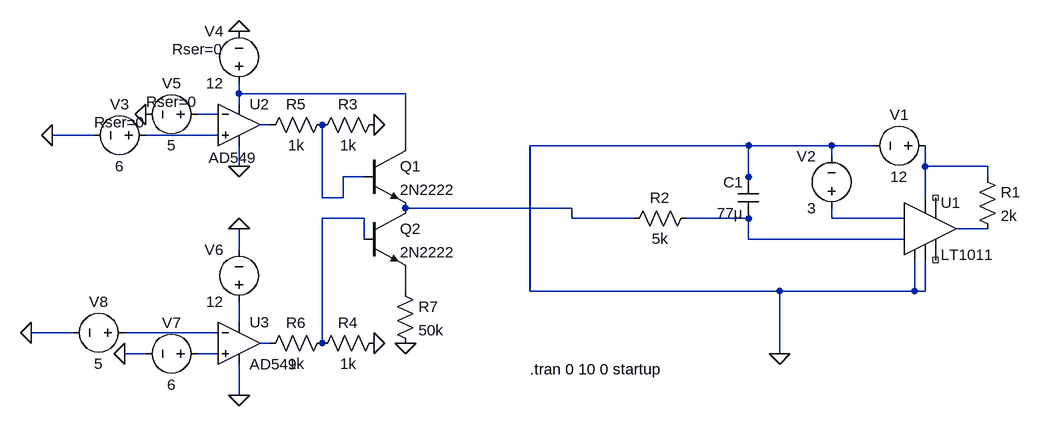
[diagram p0: schematic LT1011_TEST.asc]
LT1011_TEST.asc, the LTspice schematic file:
Version 4
SHEET 1 880 680
WIRE -1152 32 -1152 16
WIRE -896 32 -1152 32
WIRE -1152 48 -1152 32
WIRE -1184 64 -1216 64
WIRE -1104 80 -1120 80
WIRE -1376 96 -1440 96
WIRE -1184 96 -1296 96
WIRE -896 112 -896 32
WIRE -368 112 -704 112
WIRE -240 112 -368 112
WIRE -176 112 -240 112
WIRE -240 128 -240 112
WIRE -1152 144 -1152 112
WIRE -96 144 -96 112
WIRE 0 144 -96 144
WIRE -960 160 -992 160
WIRE -368 160 -368 112
WIRE 0 160 0 144
WIRE -368 176 -368 160
WIRE -1024 192 -1024 80
WIRE -992 192 -992 160
WIRE -992 192 -1024 192
WIRE -96 192 -96 144
WIRE -640 208 -896 208
WIRE -960 224 -1024 224
WIRE -640 224 -640 208
WIRE -544 224 -640 224
WIRE -368 224 -464 224
WIRE -240 224 -240 208
WIRE -128 224 -240 224
WIRE 0 240 -48 240
WIRE -960 256 -960 224
WIRE -368 256 -368 224
WIRE -128 256 -368 256
WIRE -1152 272 -1152 240
WIRE -896 336 -896 304
WIRE -704 336 -704 112
WIRE -320 336 -704 336
WIRE -112 336 -112 288
WIRE -112 336 -320 336
WIRE -96 336 -96 288
WIRE -96 336 -112 336
WIRE -1152 384 -1152 352
WIRE -1408 400 -1472 400
WIRE -1184 400 -1328 400
WIRE -1104 416 -1120 416
WIRE -1024 416 -1024 224
WIRE -1296 432 -1328 432
WIRE -1184 432 -1216 432
WIRE -320 432 -320 336
WIRE -1152 496 -1152 448
FLAG -320 432 0
FLAG -1440 96 0
FLAG -1152 -64 0
FLAG -1152 144 0
FLAG -1296 64 0
FLAG -1152 496 0
FLAG -1152 240 0
FLAG -1328 432 0
FLAG -1472 400 0
FLAG -944 80 0
FLAG -944 416 0
FLAG -896 416 0
SYMBOL Comparators\\LT1011 -96 240 R0
SYMATTR InstName U1
SYMBOL voltage -80 112 R90
WINDOW 0 -32 56 VBottom 2
WINDOW 3 32 56 VTop 2
SYMATTR InstName V1
SYMATTR Value 12
SYMBOL res -16 144 R0
SYMATTR InstName R1
SYMATTR Value 2k
SYMBOL res -448 208 R90
WINDOW 0 0 56 VBottom 2
WINDOW 3 32 56 VTop 2
SYMATTR InstName R2
SYMATTR Value 5k
SYMBOL cap -352 224 R180
WINDOW 0 24 56 Left 2
WINDOW 3 24 8 Left 2
SYMATTR InstName C1
SYMATTR Value 77µ
SYMBOL voltage -240 224 R180
WINDOW 0 24 96 Left 2
WINDOW 3 24 16 Left 2
WINDOW 123 0 0 Left 0
WINDOW 39 0 0 Left 0
SYMATTR InstName V2
SYMATTR Value 3
SYMBOL OpAmps\\AD549 -1152 16 R0
WINDOW 3 -47 115 Left 2
SYMATTR InstName U2
SYMBOL voltage -1280 96 R90
WINDOW 0 -32 56 VBottom 2
WINDOW 3 32 56 VTop 2
WINDOW 123 0 0 Left 0
WINDOW 39 -4 56 VBottom 2
SYMATTR InstName V3
SYMATTR Value 6
SYMATTR SpiceLine Rser=0
SYMBOL res -928 64 R90
WINDOW 0 0 56 VBottom 2
WINDOW 3 32 56 VTop 2
SYMATTR InstName R3
SYMATTR Value 1k
SYMBOL voltage -1152 32 R180
WINDOW 0 24 96 Left 2
WINDOW 3 24 16 Left 2
WINDOW 123 0 0 Left 0
WINDOW 39 24 68 Left 2
SYMATTR InstName V4
SYMATTR Value 12
SYMATTR SpiceLine Rser=0
SYMBOL voltage -1200 64 R90
WINDOW 0 -32 56 VBottom 2
WINDOW 3 32 56 VTop 2
WINDOW 123 0 0 Left 0
WINDOW 39 -4 56 VBottom 2
SYMATTR InstName V5
SYMATTR Value 5
SYMATTR SpiceLine Rser=0
SYMBOL OpAmps\\AD549 -1152 352 R0
SYMATTR InstName U3
SYMBOL voltage -1152 368 R180
WINDOW 0 24 96 Left 2
WINDOW 3 24 16 Left 2
WINDOW 123 0 0 Left 0
WINDOW 39 0 0 Left 0
SYMATTR InstName V6
SYMATTR Value 12
SYMBOL voltage -1200 432 R90
WINDOW 0 -32 56 VBottom 2
WINDOW 3 32 56 VTop 2
WINDOW 123 0 0 Left 0
WINDOW 39 0 0 Left 0
SYMATTR InstName V7
SYMATTR Value 6
SYMBOL voltage -1312 400 R90
WINDOW 0 -32 56 VBottom 2
WINDOW 3 32 56 VTop 2
WINDOW 123 0 0 Left 0
WINDOW 39 0 0 Left 0
SYMATTR InstName V8
SYMATTR Value 5
SYMBOL res -928 400 R90
WINDOW 0 0 56 VBottom 2
WINDOW 3 32 56 VTop 2
SYMATTR InstName R4
SYMATTR Value 1k
SYMBOL res -1008 64 R90
WINDOW 0 0 56 VBottom 2
WINDOW 3 32 56 VTop 2
SYMATTR InstName R5
SYMATTR Value 1k
SYMBOL res -1008 400 R90
WINDOW 0 0 56 VBottom 2
WINDOW 3 32 56 VTop 2
SYMATTR InstName R6
SYMATTR Value 1k
SYMBOL npn -960 112 R0
SYMATTR InstName Q1
SYMATTR Value 2N2222
SYMBOL npn -960 208 R0
SYMATTR InstName Q2
SYMATTR Value 2N2222
SYMBOL res -912 320 R0
SYMATTR InstName R7
SYMATTR Value 50k
TEXT -704 456 Left 2 !.tran 0 10 0 startup

The netlist it stands for:
* LT1011_TEST.asc
XU1 0 N009 N010 0 NC_01 NC_02 N011 N005 LT1011
V1 N005 0 12
R1 N005 N011 2k
R2 N009 N007 5k
C1 N009 0 77µ
V2 N010 0 3
XU2 N004 N002 N001 0 N003 AD549  ; pins In+ In- V+ V- OUT
V3 N004 0 6 Rser=0
R3 0 N006 1k
V4 N001 0 12 Rser=0
V5 N002 0 5 Rser=0
XU3 N016 N014 N013 0 N015 AD549  ; pins In+ In- V+ V- OUT
V6 N013 0 12
V7 N016 0 6
V8 N014 0 5
R4 0 N008 1k
R5 N006 N003 1k
R6 N008 N015 1k
Q1 N001 N006 N007 0 2N2222
Q2 N007 N008 N012 0 2N2222
R7 N012 0 50k
.model NPN NPN
.model PNP PNP
.lib standard.bjt
.tran 0 10 0 startup
.lib LTC1.lib
.backanno
.end